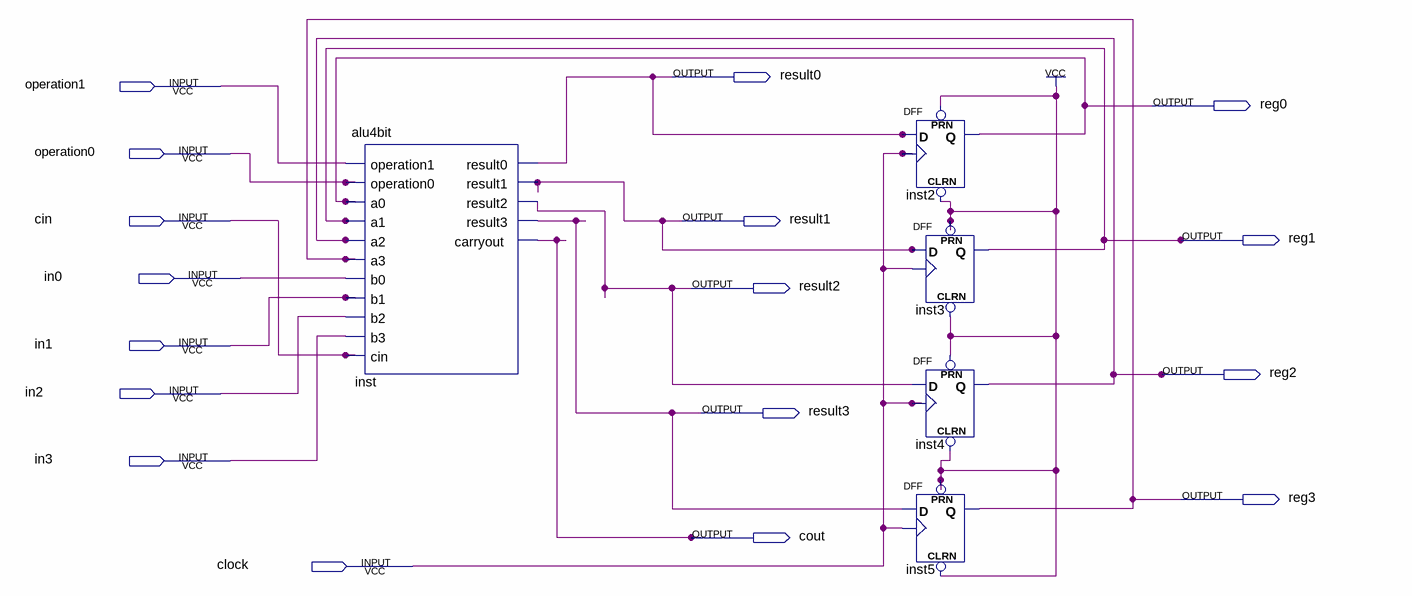
[diagram p0: schematic sheet]
// Quartus schematic system.bdf as structural Verilog: 5 symbols, 17 pins
module system (
  input  operation1,
  input  operation0,
  input  cin,
  input  in0,
  input  in1,
  input  in2,
  input  in3,
  input  clock,
  output result0,
  output reg0,
  output result1,
  output reg1,
  output result2,
  output reg2,
  output result3,
  output reg3,
  output cout
);

  alu4bit inst (
    .operation1(operation1), .operation0(operation0), .a0(reg0), .a1(reg1), .a2(reg2), .a3(reg3), .b0(in0),
    .b1(in1), .b2(in2), .b3(in3), .cin(cin), .result0(result0), .result1(result1), .result2(result2),
    .result3(result3), .carryout(cout));
  DFF inst2 (.CLRN(1'b1), .CLK(clock), .D(result0), .PRN(1'b1), .Q(reg0));
  DFF inst3 (.CLRN(1'b1), .CLK(clock), .D(result1), .PRN(1'b1), .Q(reg1));
  DFF inst4 (.CLRN(1'b1), .CLK(clock), .D(result2), .PRN(1'b1), .Q(reg2));
  DFF inst5 (.CLRN(1'b1), .CLK(clock), .D(result3), .PRN(1'b1), .Q(reg3));
endmodule
